# EAGLE design pow3.5e2 (EAGLE 7.3.0)
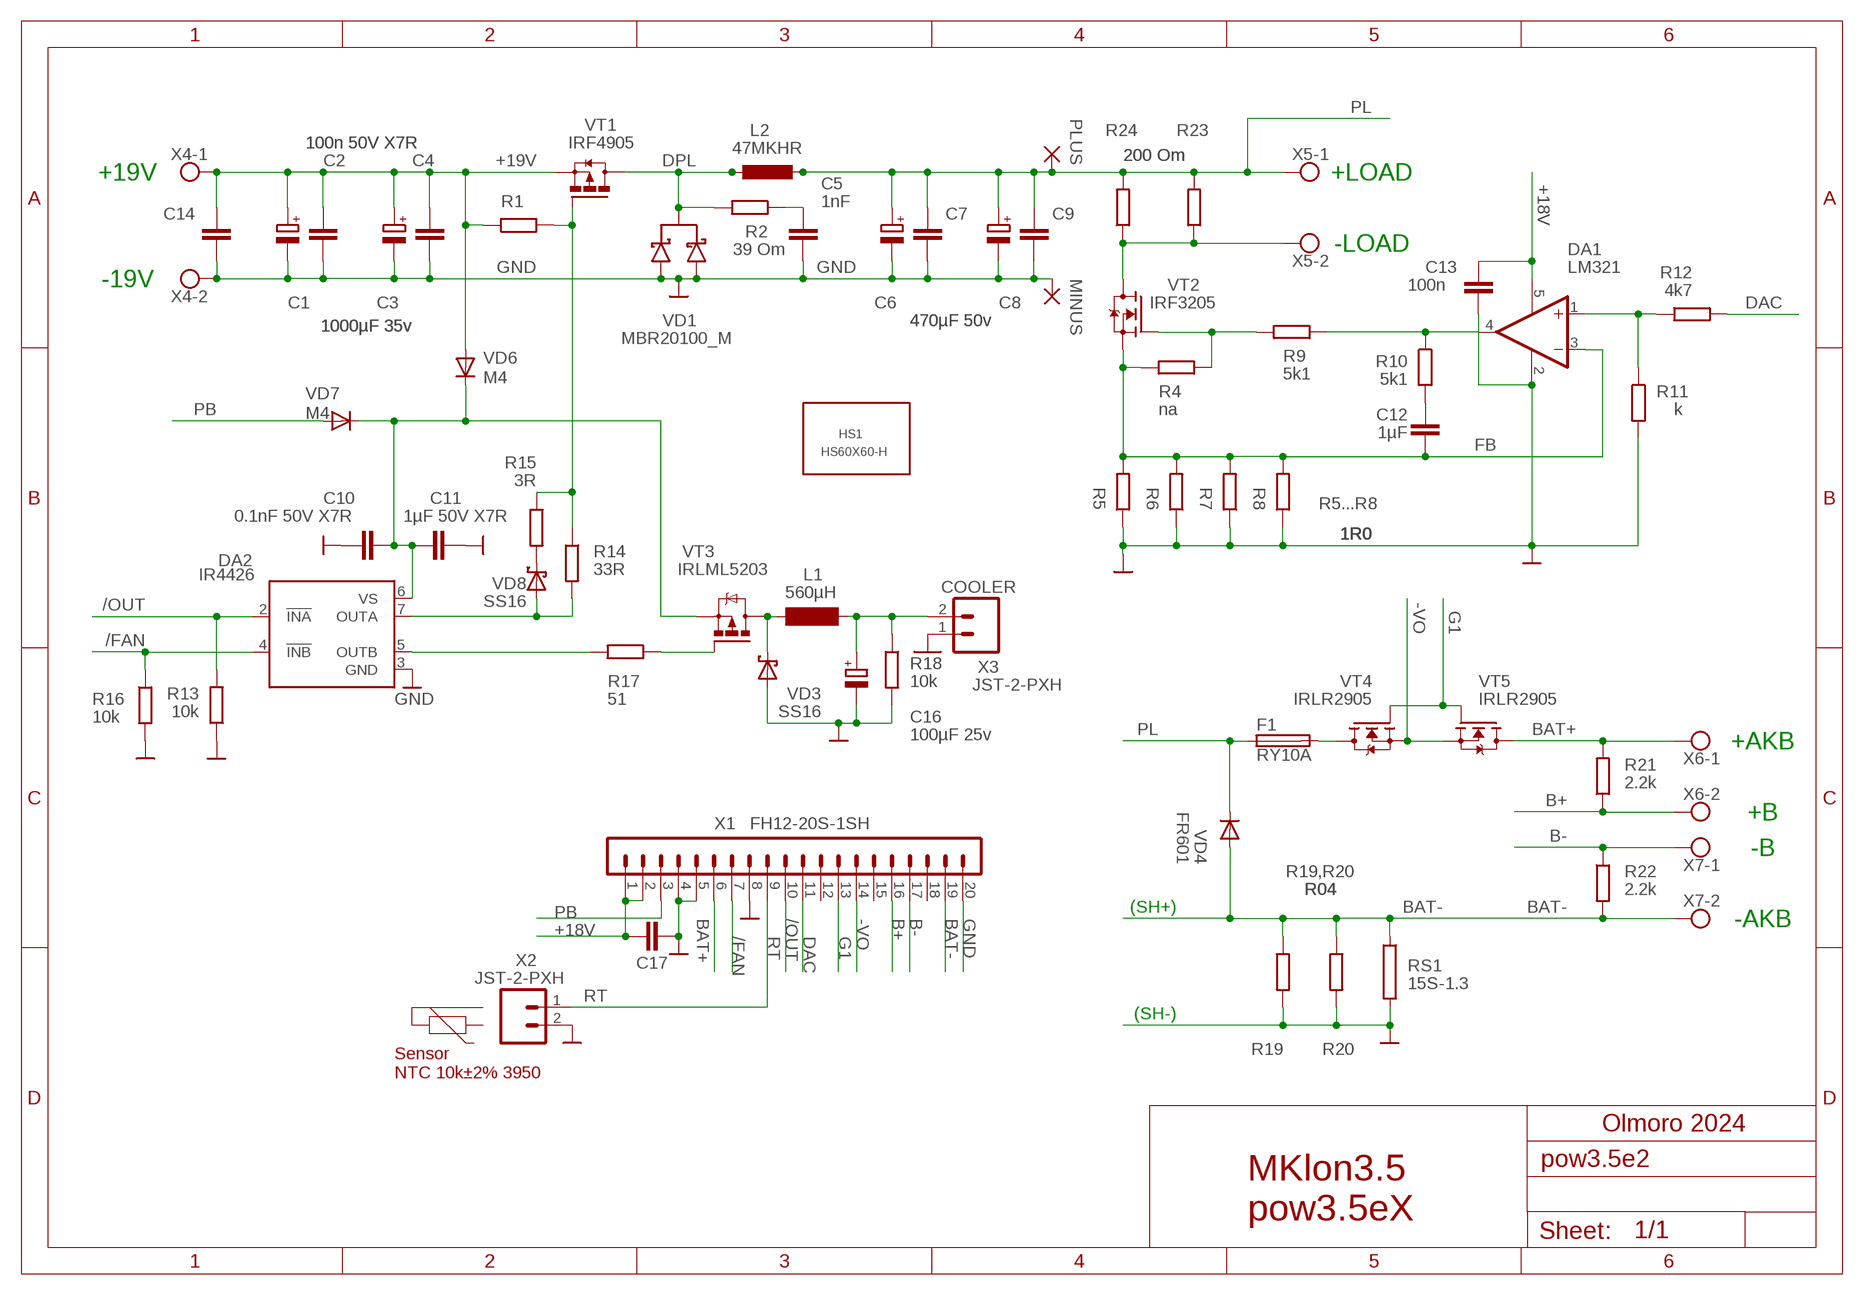
[diagram p0: schematic, sheet 1]

## Parts
C1  1000µF 35v  CPOL-EUE5-10.5  [E5-10,5]
C2  100n 50V X7R  C-EUC0805  [C0805]
C3  1000µF 35v  CPOL-EUE5-10.5  [E5-10,5]
C4  100n 50V X7R  C-EUC0805  [C0805]
C5  1nF  C-EU075-042X103  [C075-042X103]
C6  470µF 50v  CPOL-EUE5-10.5  [E5-10,5]
C7  1mkF 50V X7R  C-EUC0805  [C0805]
C8  470µF 50v  CPOL-EUE5-10.5  [E5-10,5]
C9  1mkF 50V X7R  C-EUC0805  [C0805]
C10  0.1nF 50V X7R  C-EUC0805  [C0805]
C11  1µF 50V X7R  C-EUC0805  [C0805]
C12  1µF  C-EUC0805  [C0805]
C13  100n  C-EUC0805  [C0805]
C14  1mkF 50V X7R  C-EUC0805  [C0805]
C16  100µF 25v  CPOL-EUE5-6  [E5-6]
C17  C-EUC0805  [C0805]
DA1  LM321  LM321MF  [SOT23-5]
DA2  IR4426  [DIL08]
F1  RY10A  [RY10A]
HS1  HS60X60-H  [HS60X60-H]
L1  560µH  BS11  [BS11]
L2  47MKHR  [47MKHR]
MINUS  3,81/1,4  [3,81/1,4]
PLUS  3,81/1,4  [3,81/1,4]
R1  R-EU_R1206  [R1206]
R2  39 Om  R-EU_0414/15  [0414/15]
R4  na  R-EU_R1206  [R1206]
R5  1R0  R-EU_R2512  [R2512]
R6  1R0  R-EU_R2512  [R2512]
R7  1R0  R-EU_R2512  [R2512]
R8  1R0  R-EU_R2512  [R2512]
R9  5k1  R-EU_R0805  [R0805]
R10  5k1  R-EU_R0805  [R0805]
R11  k  R-EU_R0805  [R0805]
R12  4k7  R-EU_R0805  [R0805]
R13  10k  R-EU_R0805  [R0805]
R14  33R  R-EU_R1206  [R1206]
R15  3R  R-EU_R1206  [R1206]
R16  10k  R-EU_R0805  [R0805]
R17  51  R-EU_R0805  [R0805]
R18  10k  R-EU_R0805  [R0805]
R19  R04  R-EU_R2512  [R2512]
R20  R04  R-EU_R2512  [R2512]
R21  2.2k  R-EU_R1206  [R1206]
R22  2.2k  R-EU_R1206  [R1206]
R23  200 Om  R-EU_0414/15  [0414/15]
R24  200 Om  R-EU_0414/15  [0414/15]
RS1  15S-1.3  [15S-1.3]
VD1  MBR20100_M  [TO220DLK]
VD3  SS16  [DO214AC]
VD4  FR601  DIODE-1_DIODE-P6-15  [DIODE-1_P6-15]
VD6  M4  DIODE-DO214AC  [DO214AC]
VD7  M4  DIODE-DO214AC  [DO214AC]
VD8  SS16  [DO214AC]
VT1  IRF4905  IRFP9540N_M  [TO-220FP_M]
VT2  IRF3205  STP16NF06FP  [TO-220FP_M]
VT3  IRLML5203  [MICRO3]
VT4  IRLR2905  [TO252]
VT5  IRLR2905  [TO252]
X1  FH12-20S-1SH  [FH12-20S-1SH]
X2  JST-2-PXH  [JST-2-PXH]
X3  JST-2-PXH  [JST-2-PXH]
X4  AK500/2  [AK500/2]
X5  AK500/2  [AK500/2]
X6  AK500/2  [AK500/2]
X7  AK500/2  [AK500/2]

## Nets
+18V: C13.2 C17.2 DA1.5(V+) X1.1 X1.2
+19V: C1.+ C2.2 C3.+ C4.2 C14.1 R1.1 VD6.A VT1.3(S) X4.1
-LD: R23.1 R24.1 VT2.2(D) X5.2
-VO: VT4.3(S) VT5.3(S) X1.14
/FAN: DA2.4(!INB) R16.1 X1.7
/OUT: DA2.2(!INA) R13.2 X1.10
B+: R21.1 X1.16 X6.2
B-: R22.1 X1.17 X7.1
BAT+: R21.2 VT5.4(D) X1.6 X6.1
BAT-: R19.1 R20.1 R22.2 RS1.1 VD4.A X1.19 X7.2
COOLER: C16.+ L1.2 R18.1 X3.2
DAC: R12.2 X1.11
DPL: L2.1 L2.1@2 R2.2 VD1.2(C) VT1.2(D)
FB: C12.2 DA1.3(-IN) R4.1 R5.2 R6.2 R7.2 R8.2 VT2.3(S)
G1: VT4.1(G) VT5.1(G) X1.13
GND: C1.- C2.1 C3.- C4.1 C5.2 C6.- C7.2 C8.- C9.2 C10.1 C11.1 C13.1 C14.2 C16.- C17.1 DA1.2(V-) DA2.3(GND) MINUS.1(P) R5.1 R6.1 R7.1 R8.1 R11.2 R13.1 R16.2 R18.2 R19.2 R20.2 RS1.2 VD1.1(A1) VD1.3(A2) VD3.A X1.4 X1.5 X1.8 X1.20 X2.2 X3.1 X4.2 ; supply symbol labelled 
N$1: DA2.5(OUTB) R17.2
N$2: C10.2 C11.2 DA2.6(VS) VD6.C VD7.C VT3.2(S)
N$3: R1.2 R14.1 R15.1 VT1.1(G)
N$7: R17.1 VT3.1(G)
N$8: L1.1 VD3.C VT3.3(D)
N$10: F1.2 VT4.4(D)
N$13: DA1.1(+IN) R11.1 R12.1
N$15: R4.2 R9.2 VT2.1(G)
N$22: R15.2 VD8.C
N$38: C12.1 R10.2
N$49: C5.1 R2.1
N$56: DA2.7(OUTA) R14.2 VD8.A
PB: VD7.A X1.3
PL: C6.+ C7.1 C8.+ C9.1 F1.1 L2.2@7 L2.2@8 PLUS.1(P) R23.2 R24.2 VD4.C X5.1
RT: X1.9 X2.1
UDAC1: DA1.4(OUT) R9.1 R10.1
Unconnected: X1.12 X1.15 X1.18

## Notes on the sheet
- +19V | +LOAD
- -LOAD
- -19V
- R5...R8
- +AKB
- +B
- -B
- R19,R20
- (SH+)
- -AKB
- (SH-)
- Sensor
  NTC 10k±2% 3950
- Olmoro 2024
- MKlon3.5
  pow3.5eX

## Library data of the parts
C1 C3 C6 C8 C16 = rcl_moro:CPOL-EU: POLARIZED CAPACITOR, European symbol
C2 C4 C5 C7 C9-C14 C17 = rcl_moro:C-EU: CAPACITOR, European symbol
DA1 = linear:LM321?*: Low Power Single Op Amp Source: http://cache.national.com/ds/LM/LM321.pdf
DA2 = ir:IR4426: DUAL LOW SIDE DRIVER Source: ID4426.pdf; MF: INTERNATIONAL RECTIFIER(IR); MPN: IR4426PBF; OC_FARNELL: 1023265; OC_NEWARK: 19K8460
F1 = fuse_moro:RY10A
HS1 = MKlon:HS60X60-H
L1 = inductor-neosid-moro:BS: INDUCTOR nominal inductance, magnetically screened; OC_FARNELL: unknown; OC_NEWARK: unknown
L2 = MKlon:47MKHR
MINUS PLUS = wirepad:3,81/1,4: THROUGH-HOLE PAD
R1 R2 R4-R24 = rcl_moro:R-EU_: RESISTOR, European symbol
RS1 = Q921:15S-1.3
VD1 = wx-d21:MBR20100_M
VD3 VD8 = diode-1:SS16
VD4 = urc-2base:DIODE-1_DIODE-: DIODE
VD6 VD7 = diode:DIODE-: DIODE
VT1 = wx-d21:IRFP9540N_M
VT2 = wx-d21:STP16NF06FP
VT3 = transistor-power:IRLML5203: HEXFET P-Channel Power MOSFET
VT4 VT5 = transistor-fet_moro:IRLR2905
X1 = wx-d21:FH12-20S-1SH
X2 X3 = MKlon:JST-2-PXH
X4-X7 = con-ptr500_moro:AK500/2: CONNECTOR; OC_FARNELL: unknown; OC_NEWARK: unknown

## Board
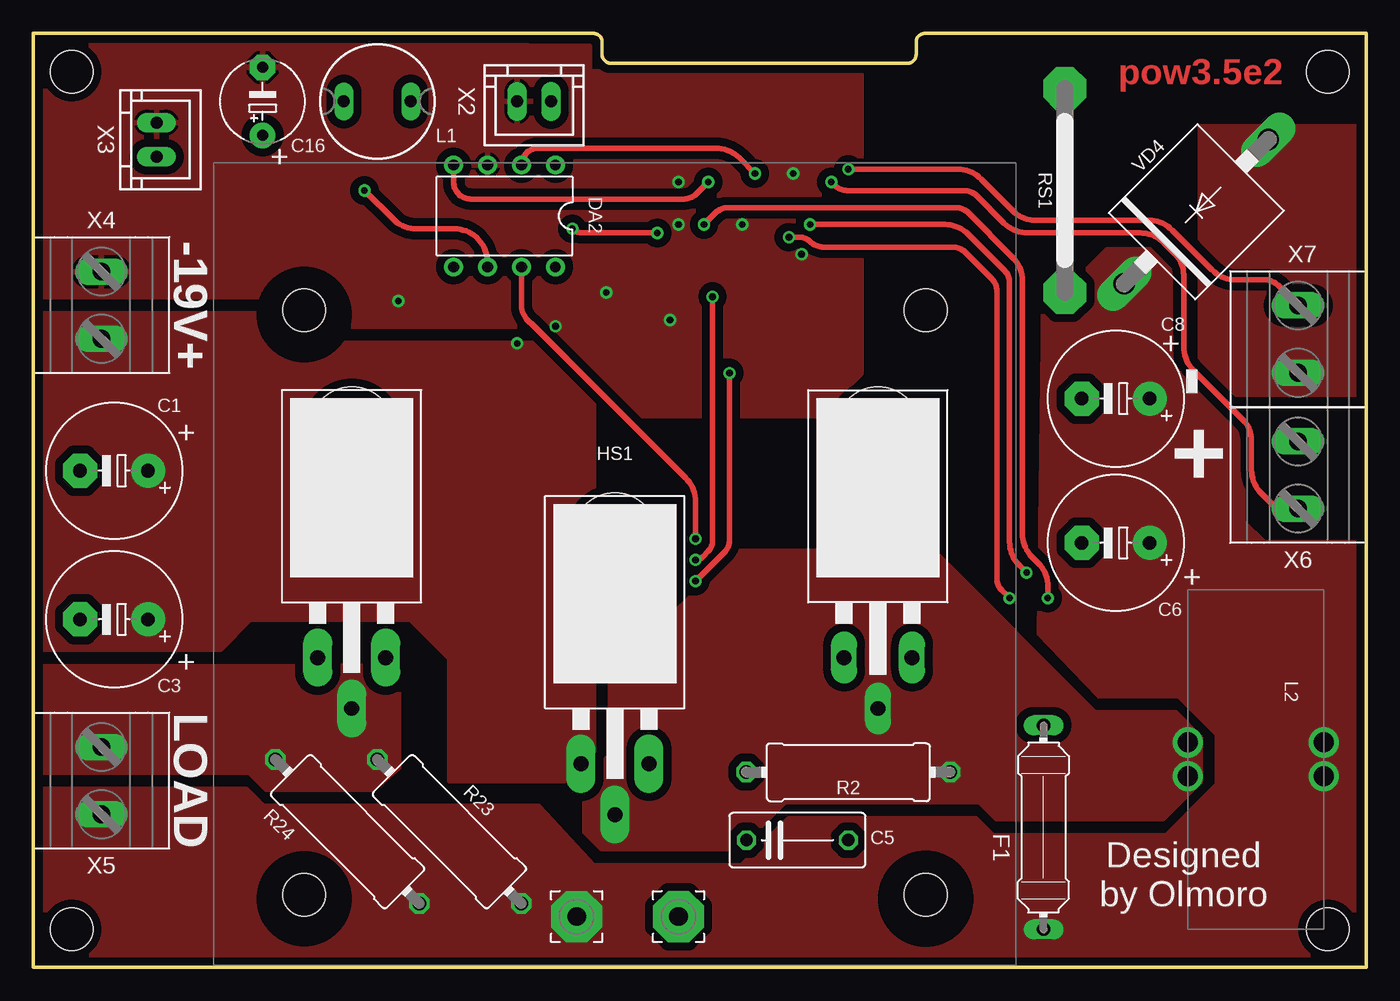
[diagram p1: board, top side]
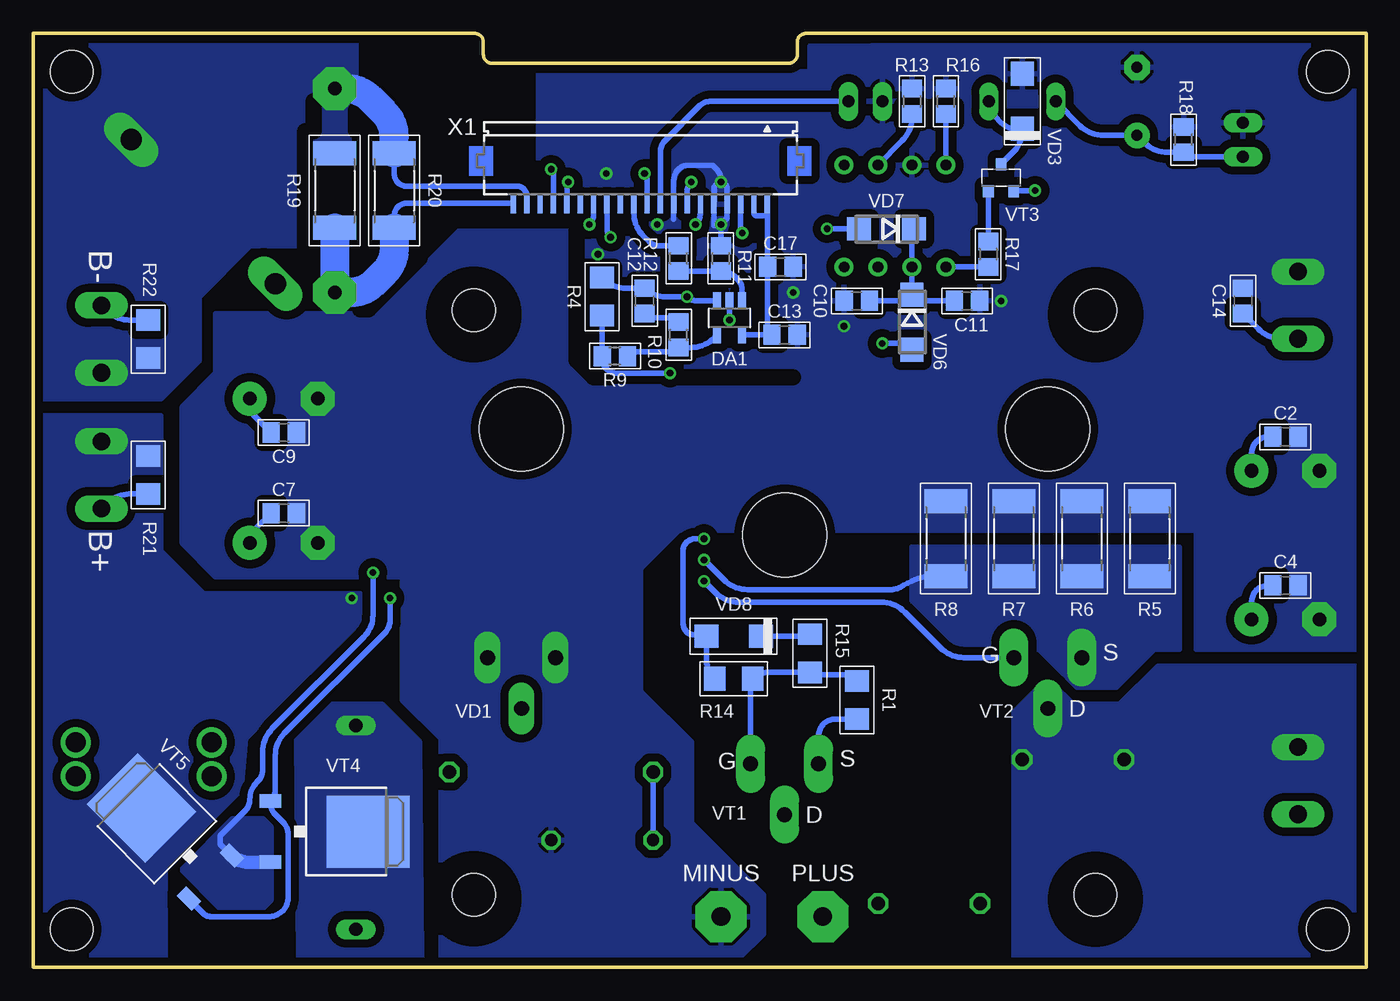
[diagram p2: board, bottom side, seen from below]

Size 99.69 x 69.85 mm. Coordinates in mm from the lower left corner, seen from the top.
Outline: 0,0 99.69,0 99.69,69.85 66.68,69.85 arc90 66.04,69.22 66.04,68.26 arc-90 65.4,67.63 43.18,67.63 arc-90 42.54,68.26 42.54,69.22 arc90 41.91,69.85 0,69.85 0,0
Copper layers (1*16): Top 0.035mm / dielectric 1.5mm / Bottom 0.035mm
Design rules "default *": minimum track width 16mil, minimum drill 19mil, track to track 12mil, track to pad 12mil, pad to pad 12mil, via to via 12mil, smd to smd 12mil, copper to edge 15mil, drill to drill 12mil, minimum pad ring 10mil, minimum via ring 8mil, stop-mask expansion 4mil, vias tented up to drill 0mil, thermal gap 10mil
Holes 3.2 mm at 2.86,2.86 2.86,66.99 96.84,66.99 96.84,2.86
tRestrict: area 17.3,2.2 to 23.2,8.1; area 63.8,2.2 to 69.7,8.1; area 63.8,45.9 to 69.7,51.8; area 17.3,45.9 to 23.2,51.8
bRestrict: area 17.3,2.2 to 23.2,8.1; area 63.8,2.2 to 69.7,8.1; area 17.3,45.9 to 23.2,51.8; area 63.8,45.9 to 69.7,51.8; 17 lines
vRestrict: area 0.6,64.8 to 5.1,69.2; area 94.6,64.8 to 99.1,69.2; area 94.6,0.6 to 99.1,5.1; area 0.6,0.6 to 5.1,5.1

### Footprints (pad centres in the part's own frame; a part is rotated, then mirrored left to right if it is on the bottom)
E5-10,5 = drill 1.016 pad 2.54: + -2.54,0 | drill 1.016 pad 2.54 octagon: - 2.54,0
C0805 = smd 1.3 x 1.5: 1 -0.95,0; 2 0.95,0
C075-042X103 = drill 0.914 octagon: 1 -3.81,0; 2 3.81,0
E5-6 = drill 0.813 pad 1.905: + -2.54,0 | drill 0.813 pad 1.905 octagon: - 2.54,0
SOT23-5 = smd 0.6 x 1.2: 1 -0.95,-1.306; 2 0,-1.306; 3 0.95,-1.306; 4 0.95,1.306; 5 -0.95,1.306
DIL08 = drill 0.8 pad 1.4: 1 -3.81,-3.81; 2 -1.27,-3.81; 3 1.27,-3.81; 4 3.81,-3.81; 5 3.81,3.81; 6 1.27,3.81; 7 -1.27,3.81; 8 -3.81,3.81
RY10A = drill 1 long: 1 -7.62,0; 2 7.62,0
HS60X60-H = hole 3.2: -23.25,18.997; 23.25,18.997; -23.25,-24.712; 23.25,-24.712
BS11 = drill 0.9 long: 1 -2.5,0; 2 2.5,0
47MKHR = drill 1.5: 1 -1.27,5.08; 1@2 1.27,5.08; 2@7 -1.27,-5.08; 2@8 1.27,-5.08
3,81/1,4 = drill 1.397 pad 3.81 octagon: 1 0,0
R1206 = smd 1.6 x 1.803: 1 -1.422,0; 2 1.422,0
0414/15 = drill 1.016 octagon: 1 -7.62,0; 2 7.62,0
R2512 = smd 1.8 x 3.2: 1 -2.8,0; 2 2.8,0
R0805 = smd 1.3 x 1.5: 1 -0.95,0; 2 0.95,0
15S-1.3 = drill 1 pad 3.2 octagon: 1 -7.62,0; 2 7.62,0
TO220DLK = drill 1.118 pad 1.93 long: 1 2.54,0; 2 0,-3.81; 3 -2.54,0 | hole 6.3: 0,17.1
DO214AC = smd 1.8 x 1.7: A 2.05,0; C -2.05,0
DIODE-1_P6-15 = drill 1.6 long: A 7.62,0; C -7.62,0
TO-220FP_M = drill 1.118 pad 2.184 long: 1 2.54,0; 2 0,-3.81; 3 -2.54,0 | hole 6.3: 0,17.1
MICRO3 = smd 0.8 x 0.9: 1 -0.95,-1; 2 0.95,-1; 3 0,1
TO252 = smd 1 x 1.6: 1 -2.28,-4.8; 3 2.28,-4.8 | smd 5.4 x 6.2: 4 0,2.5
FH12-20S-1SH = smd 0.406 x 1.321: 1 9.5,-3.25; 2 8.5,-3.25; 3 7.5,-3.25; 4 6.5,-3.25; 5 5.5,-3.25; 6 4.5,-3.25; 7 3.5,-3.25; 8 2.5,-3.25; 9 1.5,-3.25; 10 0.5,-3.25; 11 -0.5,-3.25; 12 -1.5,-3.25; 13 -2.5,-3.25; 14 -3.5,-3.25; 15 -4.5,-3.25; 16 -5.5,-3.25; 17 -6.5,-3.25; 18 -7.5,-3.25; 19 -8.5,-3.25; 20 -9.5,-3.25
JST-2-PXH = drill 0.9 pad 1.448 long: 1 -1.27,0; 2 1.27,0
AK500/2 = drill 1.321 long: 1 -2.515,0; 2 2.515,0

### Placement (x,y rotation side)
C1  6.03,37.15 180 top
C2  6.03,39.69 180 bottom
C3  6.03,26.04 180 top
C4  6.03,28.57 180 bottom
C5  57.15,9.53 0 top
C6  80.96,31.75 180 top
C7  80.96,33.97 0 bottom
C8  80.96,42.55 180 top
C9  80.96,40.01 0 bottom
C10  38.1,49.85 0 bottom
C11  29.84,49.85 180 bottom
C12  53.97,49.85 90 bottom
C13  43.5,47.31 180 bottom
C14  9.21,49.85 90 bottom
C16  17.14,64.77 90 top
C17  43.81,52.39 180 bottom
DA1  47.62,48.58 180 bottom
DA2  35.24,56.2 180 top
F1  75.56,10.48 90 top
HS1  43.5,30.16 0 top
L1  25.72,64.77 180 top
L2  91.44,15.56 90 top
MINUS  48.26,3.81 0 top
PLUS  40.64,3.81 0 top
R1  38.1,20 90 bottom
R2  60.96,14.61 0 top
R4  57.15,50.16 270 bottom
R5  16.19,32.07 270 bottom
R6  21.27,32.07 270 bottom
R7  26.35,32.07 270 bottom
R8  31.43,32.07 270 bottom
R9  56.2,45.72 180 bottom
R10  51.43,47.31 90 bottom
R11  48.26,53.02 90 bottom
R12  51.43,53.02 90 bottom
R13  33.97,64.77 270 bottom
R14  47.31,21.59 180 bottom
R15  41.59,23.5 90 bottom
R16  31.43,64.77 90 bottom
R17  28.26,53.34 270 bottom
R18  13.65,61.91 90 bottom
R19  77.15,58.1 270 bottom
R20  72.71,58.1 270 bottom
R21  91.12,36.83 90 bottom
R22  91.12,46.99 270 bottom
R23  31.11,10.16 315 top
R24  23.49,10.16 315 top
RS1  77.15,58.1 270 top
VD1  63.18,23.18 0 bottom
VD3  25.72,64.77 90 bottom
VD4  87,56.52 45 top
VD6  33.97,48.26 270 bottom
VD7  35.88,55.25 180 bottom
VD8  47.31,24.77 180 bottom
VT1  43.5,15.24 0 top
VT2  23.81,23.18 0 top
VT3  27.3,59.05 0 bottom
VT4  77.15,10.16 270 bottom
VT5  89.85,10.16 45 bottom
X1  54.29,60.33 0 bottom
X2  37.46,64.77 180 top
X3  9.21,61.91 270 top
X4  5.08,49.53 90 top
X5  5.08,13.97 90 top
X6  94.61,36.83 270 top
X7  94.61,46.99 270 top

### Tracks (layer width: path | path; a pad name or v marks a point on that pad's centre or on a via)
+18V
  Bottom 0.406: X1.2 45.79,56.45 arc-90 45.54,56.2 44.77,56.2 | X1.1 44.79,56.22 arc-90 44.77,56.2 | DA1.5 arc45 46.58,47.31 C13.2 arc45 44.77,48.07 C17.2 arc45 C17.2 44.77,56.2
+19V  (via drill 0.5)
  Bottom 0.406: C2.2 7.3,39.69 arc-90 8.57,38.42 C1.+ | C4.2 7.3,28.57 arc-90 8.57,27.31 C3.+ | R1.1 39.69,18.58 arc-90 40.96,17.31 VT1.3 | v36.2,46.67 34.39,46.67 arc-45 VD6.A | C14.1 8.06,47.75 arc-45 6.29,47.02 X4.1
  pour Top (isolate 0.61, no thermals): 0.63,48.89 19.05,48.89 21.27,46.67 37.78,46.67 41.91,42.55 41.91,16.19 39.69,13.97 31.11,13.97 31.11,23.18 28.26,26.04 16.19,26.04 13.97,23.81 0.63,23.81
-LD
  pour Bottom (isolate 0.61, no thermals): 0.63,0.63 0.63,22.54 15.56,22.54 18.41,19.69 21.91,19.69 23.49,21.27 24.13,21.27 26.35,19.05 26.35,0.63
  pour Top (isolate 0.61, no thermals): 26.03,22.54 27.3,21.27 27.3,14.92 25.4,13.34 17.46,13.34 16.19,14.61 0.63,14.61 0.63,22.54 16.25,22.49 20.64,22.54
-VO  (via drill 0.5)
  Top 0.406: v58.1,55.56 68.18,55.56 arc-45 69.95,54.83 72.65,52.12 arc-45 73.02,51.23 73.02,31.83 arc45 73.76,30.07 v74.3,29.53
  Bottom 0.406: 84.77,8.25 84.93,8.41 85.72,9.21 85.72,9.84 83.87,11.69 arc-45 83.5,12.59 arc45 82.98,13.86 82.87,13.97 arc-45 82.55,14.74 82.55,16.11 arc45 81.82,17.88 74.97,24.73 arc-45 74.3,26.35 v74.3,29.53 | X1.14 57.79,56.31 arc45 v58.1,55.56
  Bottom 1.016: VT4.3 83.64,7.88 arc45 VT5.3 arc45 84.93,8.41
  pour Bottom (isolate 0.305, no thermals): 81.91,5.08 81.91,10.48 82.55,11.11 84.77,11.11 88.58,7.3 85.72,4.45 82.55,4.45
/FAN  (via drill 0.5)
  Top 0.406: DA2.4 31.43,58.74 arc90 32.7,57.47 48.69,57.47 arc45 49.58,57.84 v50.48,58.74
  Bottom 0.406: R16.1 DA2.4 | X1.7 arc45 50.8,57.09 50.8,57.97 arc45 v50.48,58.74
/OUT  (via drill 0.5)
  Top 0.406: DA2.2 arc-90 37.78,61.28 51.03,61.28 arc-45 52.8,60.55 v53.98,59.37
  Bottom 0.406: R13.2 33.97,63.58 arc45 34.7,61.82 DA2.2 | X1.10 53.79,58.93 arc-45 v53.98,59.37
B+  (via drill 0.5)
  Top 0.406: X6.2 arc-45 94.55,34.29 93.03,34.29 91.85,35.46 arc-45 91.12,37.23 91.12,39.42 arc45 90.49,40.96 86.77,44.67 arc-45 86.04,46.44 86.04,51.81 arc45 85.41,53.34 84.55,54.2 arc45 82.78,54.93 74.38,54.93 arc-45 72.61,55.66 70.54,57.73 arc45 69.64,58.1 60.85,58.1 arc-45 59.95,58.47 v59.69,58.74
  Bottom 0.406: X1.16 59.79,58.49 arc45 v59.69,58.74 | R21.1 92.49,35.41 arc-45 94.25,34.68 X6.2
B-  (via drill 0.5)
  Top 0.406: v60.96,59.69 69.13,59.69 arc-45 70.9,58.96 73.3,56.55 arc45 74.93,55.88 83.42,55.88 arc-45 85.19,55.15 88.17,52.17 arc45 89.94,51.44 92.07,51.44 arc-45 93.12,51 X7.1
  Bottom 0.406: X1.17 60.79,59.29 arc-45 v60.96,59.69 | R22.1 92.49,48.41 arc45 94.25,49.14 X7.1
BAT+  (via drill 0.5)
  Top 0.406: v75.88,27.62 75.88,28.49 arc45 75.15,30.26 74.71,30.7 arc-45 73.98,32.47 73.98,51.35 arc45 73.25,53.12 69.9,56.46 arc45 69.01,56.83 51.96,56.83 arc45 51.06,56.46 v50.17,55.56
  Bottom 0.406: X1.6 49.79,56.46 arc45 v50.17,55.56
  pour Bottom (isolate 0.61, no thermals): 75.25,27.94 87,27.94 90.17,31.12 90.17,41.27 99.06,41.27 99.06,0.63 89.85,0.63 89.85,4.13 arc9 89.85,6.03 89.85,7.62 84.14,13.34 83.82,17.15 75.25,25.72
BAT-
  Bottom 0.406: R20.1 72.71,59.37 arc-90 71.75,58.42 63.5,58.42 arc90 62.79,57.71 X1.19
  Bottom 2.184: R20.1 72.71,62.15 arc-45 73.44,63.91 74.52,64.99 arc-45 76.28,65.72 RS1.1
  pour Bottom (isolate 0.61, no thermals): 75.56,61.28 75.56,69.22 99.06,69.22 99.06,42.55 90.17,42.55 87.31,45.4 87.31,50.16 83.5,53.98 80.01,53.98 80.01,61.28
  pour Top (isolate 0.61, no thermals): 87.31,62.87 87.31,45.4 89.85,42.86 99.06,42.86 99.06,62.87
COOLER
  Bottom 0.406: L1.2 21.41,62.96 arc-45 19.64,62.23 C16.+ 16.61,61.69 arc-45 14.84,60.96 R18.1 arc-45 12.88,60.64 X3.2
DAC
  Bottom 0.406: X1.11 54.79,56.46 arc-45 54.06,54.7 53.66,54.29 arc-45 52.88,53.97 R12.2
DPL
  pour Top (isolate 0.61, no thermals): 52.7,31.12 67.31,31.12 79.38,19.05 85.41,19.05 87.31,17.15 87.31,13.97 84.45,11.11 72.07,11.11 70.8,12.38 56.2,12.38 52.7,8.89 42.54,8.89 41.27,10.16 41.27,13.97 43.18,15.88 43.18,21.91
FB  (via drill 0.5)
  Top 0.406: v50.8,50.16 50.8,31.88 arc-45 50.48,31.12 50.07,30.7 arc-45 v49.53,30.48
  Bottom 0.406: DA1.3 48.61,49.85 50.03,49.85 arc45 v50.8,50.16 52.45,50.16 arc45 C12.2 55.32,50.8 arc45 57.09,51.53 R4.1 | R8.2 31.49,29.21 33.02,29.21 arc-21 34.61,28.57 arc37 35.56,28.26 46.27,28.26 arc45 48.04,28.99 v49.53,30.48
  pour Bottom (isolate 0.61, no thermals): 33.97,26.99 33.97,31.43 13.97,31.43 13.97,23.81 15.88,23.81 18.73,20.95 21.59,20.95 24.45,23.81 30.8,23.81
G1  (via drill 0.5)
  Top 0.406: v73.02,27.62 72.44,28.2 arc-45 72.07,29.1 72.07,50.59 arc45 71.7,51.49 69.68,53.51 arc45 68.79,53.88 59.04,53.88 arc-45 58.15,54.25 58.1,54.29 arc45 57.34,54.61 v56.52,54.61
  Bottom 0.406: VT5.1 86.91,4 arc-45 86.46,3.81 82.23,3.81 arc-90 80.64,5.08 80.64,9.95 arc-45 81.02,10.85 81.58,11.41 arc45 81.95,12.31 VT4.1 arc-45 81.6,13.3 81.6,15.87 arc45 80.92,17.5 73.4,25.03 arc-45 73.02,25.93 v73.02,27.62 | X1.13 56.79,55.28 arc-45 v56.52,54.61
GND  (via drill 0.51)
  Bottom 0.406: 48.79,58.37 X1.5 48.79,55.46 | DA1.2 v47.62,48.42 | R20.2 72.71,56.2 arc90 71.75,57.15 63.97,57.15 arc45 X1.20 | R11.2 v48.26,55.56 47.79,56.03 X1.4 | 47.79,57.3 47.79,58.34 | 48.74,57.3 48.74,58.34 | v48.26,58.74 48.26,58.85 arc-45 48.63,59.74 48.89,60.01 50.67,60.01 arc-45 51.43,59.69 arc-45 51.79,58.83 X1.8 arc90 51.81,57.09 | 47.84,58.37 arc-45 48.03,58.66 | 48.37,58.68 arc-45 48.66,58.5 | 51.81,55.96 51.81,57.09 | 51.81,57.26 51.81,57.15 51.81,57.09
  Bottom 2.184: R20.2 72.71,53.74 arc45 73.44,51.97 74.2,51.21 arc45 75.97,50.48 RS1.2 R19.2
  other vias: 27.3,49.85 39.05,47.94 57.47,53.34 42.86,50.48 53.02,55.56 56.83,59.37
  pour Bottom (isolate 0.61, rank 2): 0.63,69.22 41.59,68.9 41.59,66.99 61.91,66.99 61.91,55.56 67.31,55.56 73.98,48.89 86.04,48.89 86.04,44.45 88.58,41.91 88.58,31.75 86.04,29.21 72.07,29.21 72.07,20 69.22,17.15 69.22,0.63 46.99,0.63 45.08,2.54 45.08,5.4 50.48,10.8 50.48,16.83 54.29,20.64 54.29,29.84 51.43,32.7 11.75,32.7 11.75,55.88 0.63,55.88
  pour Top (isolate 0.61): 0.63,69.22 0.63,50.16 20,50.16 22.22,47.94 38.42,47.94 45.08,41.27 58.74,41.27 61.91,44.45 61.91,66.99 41.59,66.99 41.59,68.9
  pour Bottom (isolate 0.61, rank 2, no thermals): 0.63,58.42 12.38,58.42 12.38,36.83 34.29,36.83 34.29,32.7 12.7,32.7 12.7,23.81 0.63,23.81
  pour Bottom (isolate 0.61, no thermals): 58.1,15.88 66.36,15.88 71.12,20.64 71.12,31.75 75.56,31.75 77.79,29.53 84.77,29.53 85.72,30.48 86.04,48.89 70.8,48.89 70.8,39.69 58.1,26.99
N$1
  Bottom 0.406: DA2.5 arc90 DA2.5 R17.2
N$2  (via drill 0.5)
  Top 0.406: DA2.6 33.97,52.75 arc90 31.47,55.25 28.66,55.25 arc-45 26.89,55.98 v24.77,58.1
  Bottom 0.406: VD6.C DA2.6 33.97,54.83 arc-90 33.83,54.97 VD7.C | C11.2 32.86,49.85 arc45 VD6.C | C10.2 35.09,49.85 arc-45 VD6.C | VT3.2 arc90 26.31,58.1 v24.77,58.1
N$3
  Bottom 0.406: R1.2 38.1,21.91 41.19,21.91 arc45 R15.1 44.72,22.07 arc-45 R14.1 46.04,21.59 VT1.1
N$7
  Bottom 0.406: R17.1 VT3.1 arc90 VT3.1
N$8
  Bottom 0.406: VT3.3 26.45,60.91 arc-45 25.72,62.68 VD3.C 26.19,62.72 arc45 27.3,63.18 27.74,63.62 arc45 L1.1
N$10
  pour Bottom (isolate 0.61, no thermals): 70.8,16.83 73.66,19.69 77.47,19.69 80.01,17.15 79.85,0.63 70.64,0.63
N$13
  Bottom 0.406: DA1.1 46.68,50.67 arc-45 46.99,51.44 47.18,51.63 arc-45 R11.1 R12.1
N$15  (via drill 0.5)
  Top 0.406: v52.07,44.45 52.07,31.96 arc-45 51.7,31.06 v49.53,28.89
  Bottom 0.406: R4.2 R9.2 arc-45 R9.2 57.15,45.53 arc-45 56.83,44.77 arc-45 56.07,44.45 v52.07,44.45 | v49.53,28.89 48.67,28.04 arc-45 46.91,27.31 36.28,27.31 arc45 34.51,26.57 31.85,23.91 arc-45 30.08,23.18 VT2.1
N$22
  Bottom 0.406: R15.2 41.74,24.76 45.28,24.76 arc-90 45.4,24.64 45.77,24.64 arc90 VD8.C
N$38
  Bottom 0.406: R10.2 51.43,48.58 53.2,48.58 arc45 C12.1
N$49
  Bottom 0.406: R2.1 C5.1
N$56  (via drill 0.5)
  Top 0.406: DA2.7 36.51,49.3 arc45 37.24,48.16 48.8,36.61 arc-45 49.53,34.84 v49.53,32.07
  Bottom 0.406: R14.2 arc45 49.36,23.11 VD8.A arc-45 49.66,24.89 50.34,24.89 arc45 50.8,25.08 arc45 51.12,25.85 51.12,31.12 arc90 50.17,32.07 v49.53,32.07
PB  (via drill 0.5)
  Top 0.406: v46.67,54.93 41.09,54.93 arc-45 v40.32,55.25
  Bottom 0.406: X1.3 46.79,55.22 arc-45 v46.67,54.93 | VD7.A v40.32,55.25
PL
  Bottom 0.406: C8.+ 83.5,42.12 arc-45 83.13,41.22 C9.1 | C6.+ 83.5,31.86 arc45 83.13,32.75 C7.1
  pour Top (isolate 0.61, no thermals): 75.56,46.67 75.56,48.89 80.33,53.66 83.5,53.66 85.09,52.07 85.09,45.09 90.49,39.69 90.49,33.34 92.07,31.75 99.06,31.75 99.06,0.63 0.63,0.63 0.63,13.34 15.88,13.34 17.14,12.07 37.78,12.07 41.91,7.62 53.02,7.62 56.52,11.11 70.48,11.11 71.75,9.84 84.77,9.84 88.58,13.65 88.58,17.46 85.72,20.32 79.69,20.32 75.25,24.97
RT
  Bottom 0.406: X2.1 49,64.77 arc-45 49.9,64.4 52.42,61.88 arc-45 52.79,60.98 X1.9
UDAC1
  Bottom 0.406: DA1.4 48.76,47.09 arc45 50.52,46.36 R10.1 51.43,46.04 54.48,46.04 arc-45 R9.1

### Text on the board
Top: pow3.5e2
tPlace: + | -19V+ | + | - | + | + | + | + | LOAD | Designed / by Olmoro
bPlace: B- | B+
tValues: PJ017 | PJ017 | PJ017 | PJ017